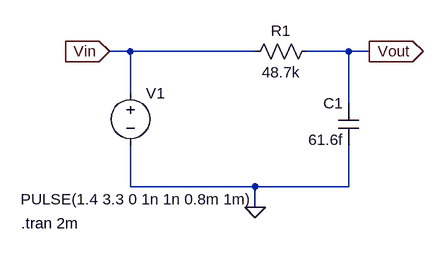
[diagram p0: schematic filtro passa baixa RC.asc]
filtro passa baixa RC.asc, the LTspice schematic file:
Version 4
SHEET 1 880 680
WIRE 0 80 -32 80
WIRE 192 80 0 80
WIRE 336 80 272 80
WIRE 368 80 336 80
WIRE 0 144 0 80
WIRE 336 160 336 80
WIRE 0 288 0 224
WIRE 192 288 0 288
WIRE 336 288 336 224
WIRE 336 288 192 288
WIRE 192 320 192 288
FLAG 192 320 0
FLAG 368 80 Vout
IOPIN 368 80 Out
FLAG -32 80 Vin
IOPIN -32 80 In
SYMBOL res 288 64 R90
WINDOW 0 0 56 VBottom 2
WINDOW 3 32 56 VTop 2
SYMATTR InstName R1
SYMATTR Value 48.7k
SYMBOL cap 352 224 R180
WINDOW 0 24 64 Left 2
WINDOW 3 24 8 Left 2
SYMATTR InstName C1
SYMATTR Value 61.6f
SYMBOL voltage 0 128 R0
WINDOW 3 -169 179 Left 2
WINDOW 123 0 0 Left 2
WINDOW 39 0 0 Left 2
SYMATTR Value PULSE(1.4 3.3 0 1n 1n 0.8m 1m)
SYMATTR InstName V1
TEXT -168 344 Left 2 !.tran 2m

The netlist it stands for:
* filtro passa baixa RC.asc
R1 Vout Vin 48.7k
C1 0 Vout 61.6f
V1 Vin 0 PULSE(1.4 3.3 0 1n 1n 0.8m 1m)
.tran 2m
.backanno
.end